# EAGLE schematic Dad_OrganShutters (EAGLE 7.7.0)
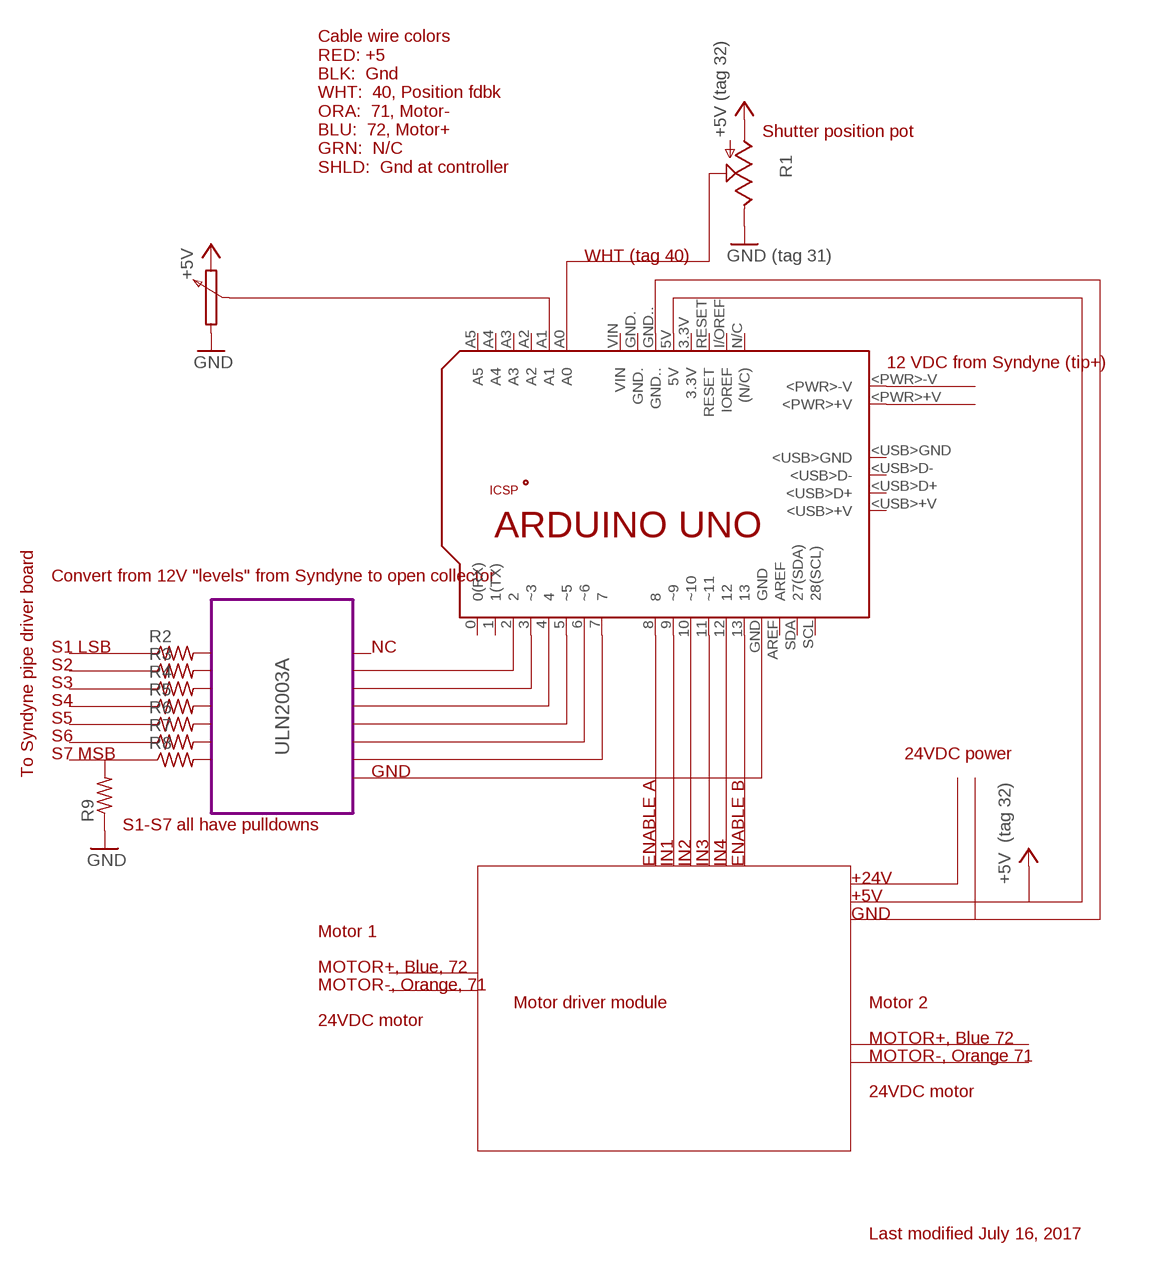
[diagram p0: schematic, sheet 1]

## Parts
PCB1  ARDUINO_UNO  [ARDUINO_UNO]
R1  TRIM_US-3223G  [3223G]
R2  R-US_0204/2V  [0204V]
R3  R-US_0204/2V  [0204V]
R4  R-US_0204/2V  [0204V]
R5  R-US_0204/2V  [0204V]
R6  R-US_0204/2V  [0204V]
R7  R-US_0204/2V  [0204V]
R8  R-US_0204/2V  [0204V]
R9  R-US_0204/2V  [0204V]

## Module instances
ULN2003A = MOTORCONTROLLER

## Nets
+5V: R1.1(A) ; supply symbol labelled +5V (tag 32)
GND: R1.3(E) R9.1 ; supply symbol labelled GND (tag 31)
Unconnected: PCB1.0(0(RX)) PCB1.1(1(TX)) PCB1.2 PCB1.3(~3) PCB1.3.3V PCB1.4 PCB1.5(~5) PCB1.5V PCB1.6(~6) PCB1.7 PCB1.8 PCB1.9(~9) PCB1.10(~10) PCB1.11(~11) PCB1.12 PCB1.13 PCB1.+5V PCB1.<PWR>+V PCB1.<PWR>-V PCB1.<USB>+V PCB1.<USB>D+ PCB1.<USB>D- PCB1.<USB>GND PCB1.A0 PCB1.A1 PCB1.A2 PCB1.A3 PCB1.A4 PCB1.A5 PCB1.AREF PCB1.GND PCB1.GND. PCB1.GND.. PCB1.GND_ PCB1.I/OREF(IOREF) PCB1.MISO PCB1.MOSI PCB1.N/C((N/C)) PCB1.RESET PCB1.RESET. PCB1.SCK PCB1.SCL(28(SCL)) PCB1.SDA(27(SDA)) PCB1.VIN R1.2(S) R2.1 R2.2 R3.1 R3.2 R4.1 R4.2 R5.1 R5.2 R6.1 R6.2 R7.1 R7.2 R8.1 R8.2 R9.2

## Notes on the sheet
- Shutter position pot
- Cable wire colors
  RED: +5
  BLK:  Gnd
  WHT:  40, Position fdbk
  ORA:  71, Motor-
  BLU:  72, Motor+
  GRN:  N/C
  SHLD:  Gnd at controller
- WHT (tag 40)
- 12 VDC from Syndyne (tip+)
- Convert from 12V "levels" from Syndyne to open collector
- S1 LSB | NC
- S2
- S3
- S4
- S5
- S6
- S7 MSB | 24VDC power
- To Syndyne pipe driver board | GND
- S1-S7 all have pulldowns
- ENABLE A | IN1 | IN2 | IN3 | IN4 | ENABLE B
- +24V
- +5V
- GND
- Motor 1
- MOTOR+, Blue, 72
- MOTOR-, Orange, 71
- Motor driver module | Motor 2
- 24VDC motor
- MOTOR+, Blue 72
- MOTOR-, Orange 71
- 24VDC motor
- Last modified July 16, 2017

## Library data of the parts
PCB1 = E14_Arduino_revC:ARDUINO_UNO: Device for representing an Arduino Uno board with a footprint in an EAGLE design. Created by Dave Young for Element14. More EAGLE documentation at: http://www.element14.com/community/community/knode/cadsoft_eagle
R1 = pot:TRIM_US-: POTENTIOMETER
R2-R9 = resistor:R-US_: RESISTOR, American symbol

## Module MOTORCONTROLLER
Ports: 

### Library data of the parts